# EAGLE schematic Schematic_V0.1 (EAGLE 9.7.0)
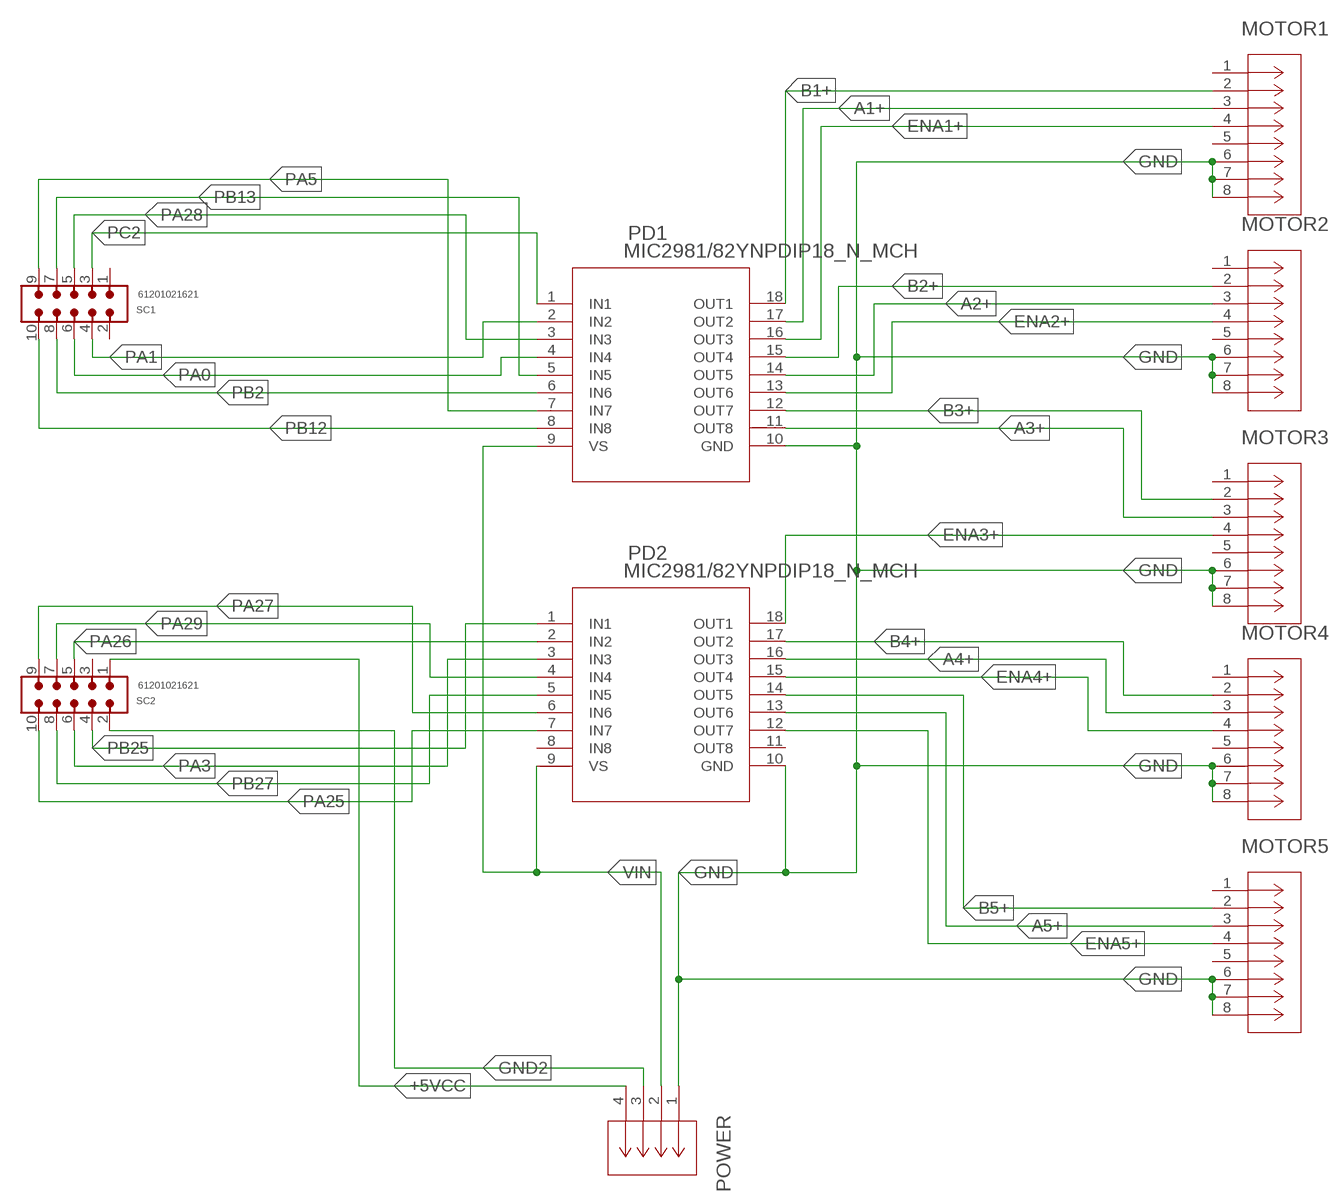
[diagram p0: schematic, sheet 1]

## Parts
MOTOR1  1724470208CON_1724470208  [CON_1724470208]
MOTOR2  1724470208CON_1724470208  [CON_1724470208]
MOTOR3  1724470208CON_1724470208  [CON_1724470208]
MOTOR4  1724470208CON_1724470208  [CON_1724470208]
MOTOR5  1724470208CON_1724470208  [CON_1724470208]
PD1  MIC2981/82YNPDIP18_N_MCH  [PDIP18_N_MCH]
PD2  MIC2981/82YNPDIP18_N_MCH  [PDIP18_N_MCH]
POWER  OSTYK42104030CONN4_K42104030_OST  [CONN4_K42104030_OST]
SC1  61201021621  6120XX21621_61201021621  [61201021621]
SC2  61201021621  6120XX21621_61201021621  [61201021621]

## Nets
+5VCC: POWER.4 SC2.1
A1+: MOTOR1.3 PD1.17(OUT2)
A2+: MOTOR2.3 PD1.14(OUT5)
A3+: MOTOR3.3 PD1.11(OUT8)
A4+: MOTOR4.3 PD2.16(OUT3)
A5+: MOTOR5.3 PD2.13(OUT6)
B1+: MOTOR1.2 PD1.18(OUT1)
B2+: MOTOR2.2 PD1.15(OUT4)
B3+: MOTOR3.2 PD1.12(OUT7)
B4+: MOTOR4.2 PD2.17(OUT2)
B5+: MOTOR5.2 PD2.14(OUT5)
ENA1+: MOTOR1.4 PD1.16(OUT3)
ENA2+: MOTOR2.4 PD1.13(OUT6)
ENA3+: MOTOR3.4 PD2.18(OUT1)
ENA4+: MOTOR4.4 PD2.15(OUT4)
ENA5+: MOTOR5.4 PD2.12(OUT7)
GND: MOTOR1.6 MOTOR1.7 MOTOR1.8 MOTOR2.6 MOTOR2.7 MOTOR2.8 MOTOR3.6 MOTOR3.7 MOTOR3.8 MOTOR4.6 MOTOR4.7 MOTOR4.8 MOTOR5.6 MOTOR5.7 MOTOR5.8 PD1.10(GND) PD2.10(GND) POWER.1
GND2: POWER.3 SC2.2
PA0: PD1.4(IN4) SC1.6
PA1: PD1.2(IN2) SC1.4
PA3: PD2.3(IN3) SC2.6
PA5: PD1.7(IN7) SC1.9
PA25: PD2.7(IN7) SC2.10
PA26: PD2.2(IN2) SC2.5
PA27: PD2.6(IN6) SC2.9
PA28: PD1.3(IN3) SC1.5
PA29: PD2.4(IN4) SC2.7
PB2: PD1.6(IN6) SC1.8
PB12: PD1.8(IN8) SC1.10
PB13: PD1.5(IN5) SC1.7
PB25: PD2.1(IN1) SC2.4
PB27: PD2.5(IN5) SC2.8
PC2: PD1.1(IN1) SC1.3
VIN: PD1.9(VS) PD2.9(VS) POWER.2
Unconnected: MOTOR1.1 MOTOR1.5 MOTOR2.1 MOTOR2.5 MOTOR3.1 MOTOR3.5 MOTOR4.1 MOTOR4.5 MOTOR5.1 MOTOR5.5 PD2.8(IN8) PD2.11(OUT8) SC1.1 SC1.2 SC2.3

## Library data of the parts
MOTOR1-MOTOR5 = 2024-10-14_18-11-13_Library:1724470208; COPYRIGHT: Copyright (C) 2024 Ultra Librarian. All rights reserved.; MANUFACTURER_PART_NUMBER: 1724470208; MFR_NAME: Molex Connector Corporation
PD1 PD2 = 2024-10-01_17-12-49_Library:MIC2981/82YN; COPYRIGHT: Copyright (C) 2024 Ultra Librarian. All rights reserved.; MANUFACTURER_PART_NUMBER: MIC2981/82YN; MFR_NAME: Micrel / Microchip Technology
POWER = 2024-10-15_17-28-16_Library:OSTYK42104030; COPYRIGHT: Copyright (C) 2024 Ultra Librarian. All rights reserved.; DIGI-KEY_PART_NUMBER_1: ED2947-ND; DIGI-KEY_PART_NUMBER_2: ED2947-NDL; MANUFACTURER_PART_NUMBER: OSTYK42104030; MFR_NAME: TT Electronics
SC1 SC2 = 6120XX21621_61201021621:6120XX21621_61201021621: WR-BHD 2.54 mm Male Box Header KIND PROPERTIES: Pitch 2.54 mm Gender:Male MATERIAL PROPERTIES: Insulator Material:PBT Insulator Flammability Rating UL94 V-0 Insulator Color:Black Contact Material :Copper Alloy Contact Plating :Gold Contact Type: Stamped GENERAL INFORMATION: Operating Temperature:-40 °C up to +125 °C Compliance:RoHS Working Voltage: 250 V (AC) Withstanding Voltage:500 V (AC) Contact Resistance: 20 mΩ Insulation Resistance:1000 MΩ CERTIFICATION: UL Approval:E323964 PACKAGING PROPERTIES Packaging :Tray <https://www.we-online.com/catalog/media/o32884v209%20Family_WR-BHD_6120xx21621.jpg> Details see: https://www.we-online.com/catalog/en/BHD_2_54_MALE_BOX_HEADER_6120XX21621 Updated by Ella Wu 2021-3-12 2021 (C) Würth Elektronik; CONTACT-RESISTANCE: 20mOhm; DATASHEET-URL: https://www.we-online.com/redexpert/spec/61201021621?ae; GENDER: Male; IR: 3A; LENGTH: 20.36mm; MOUNT: THT; PACKAGING: Tray; PART-NUMBER: 61201021621; PINS: 10; PITCH: 2.54mm; TYPE: Straight; WORKING-VOLTAGE: 250V(AC)